# EAGLE board PDNode-600 Pro (EAGLE 9.2.1), part 1 of 5
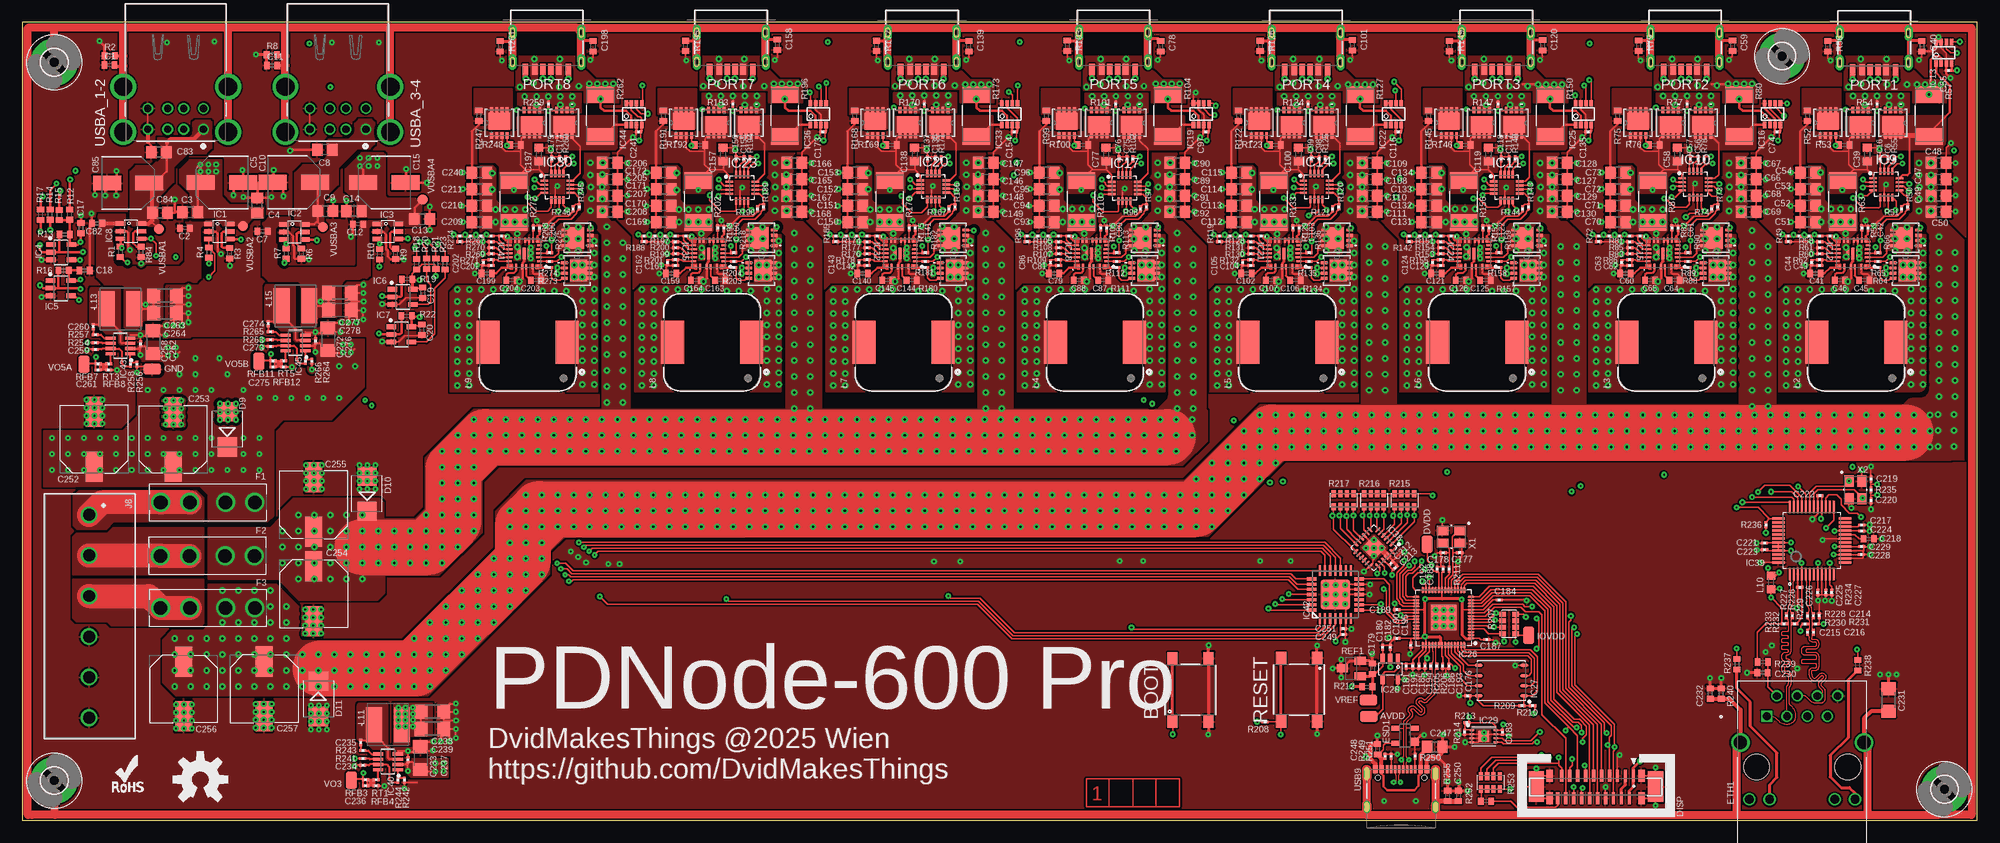
[diagram p12: board, top side]
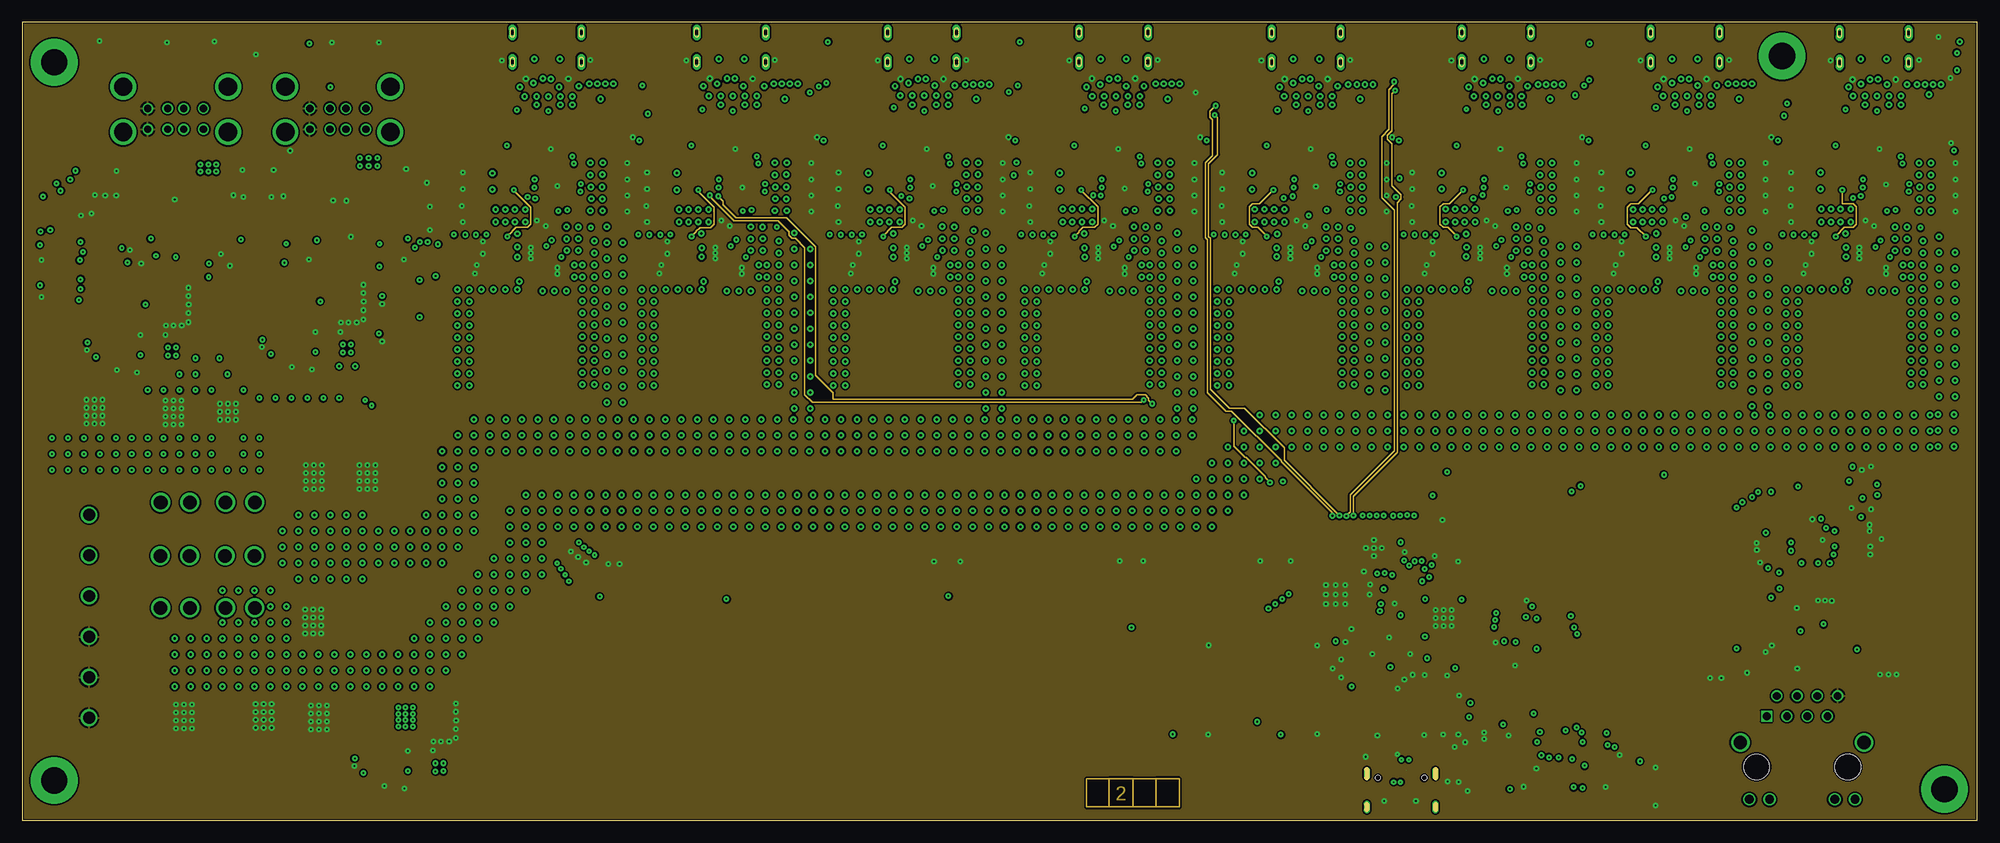
[diagram p13: board, inner layer GND]
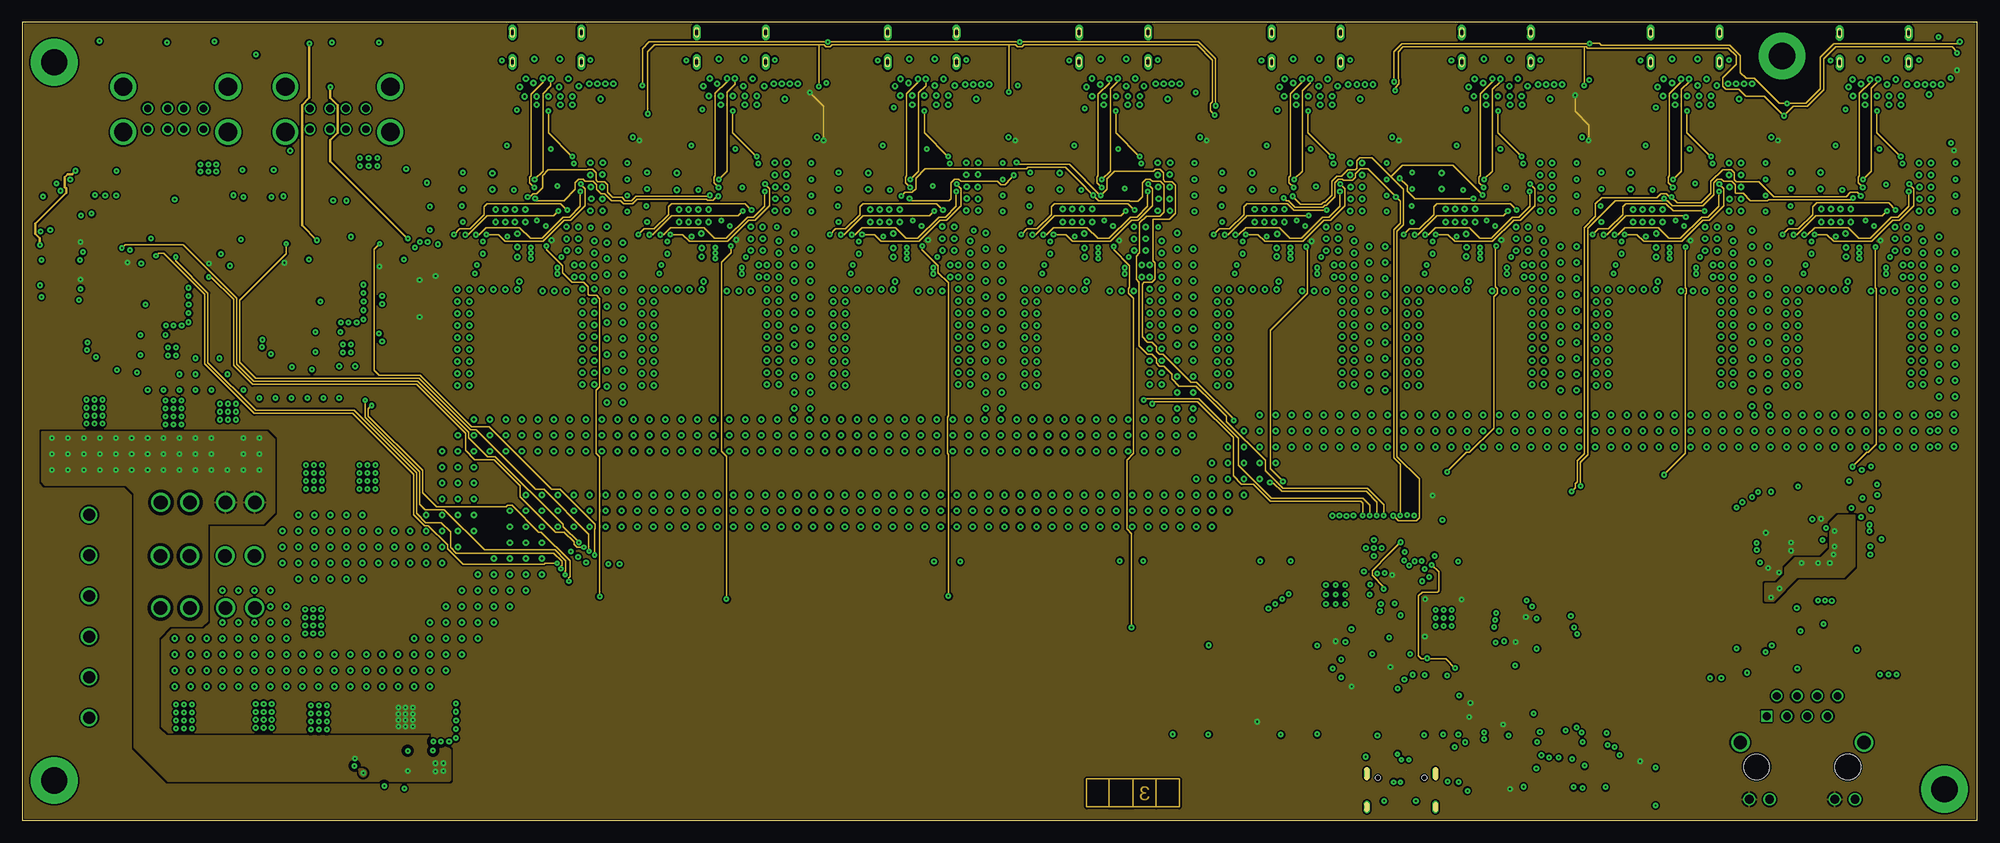
[diagram p14: board, inner layer PWR]
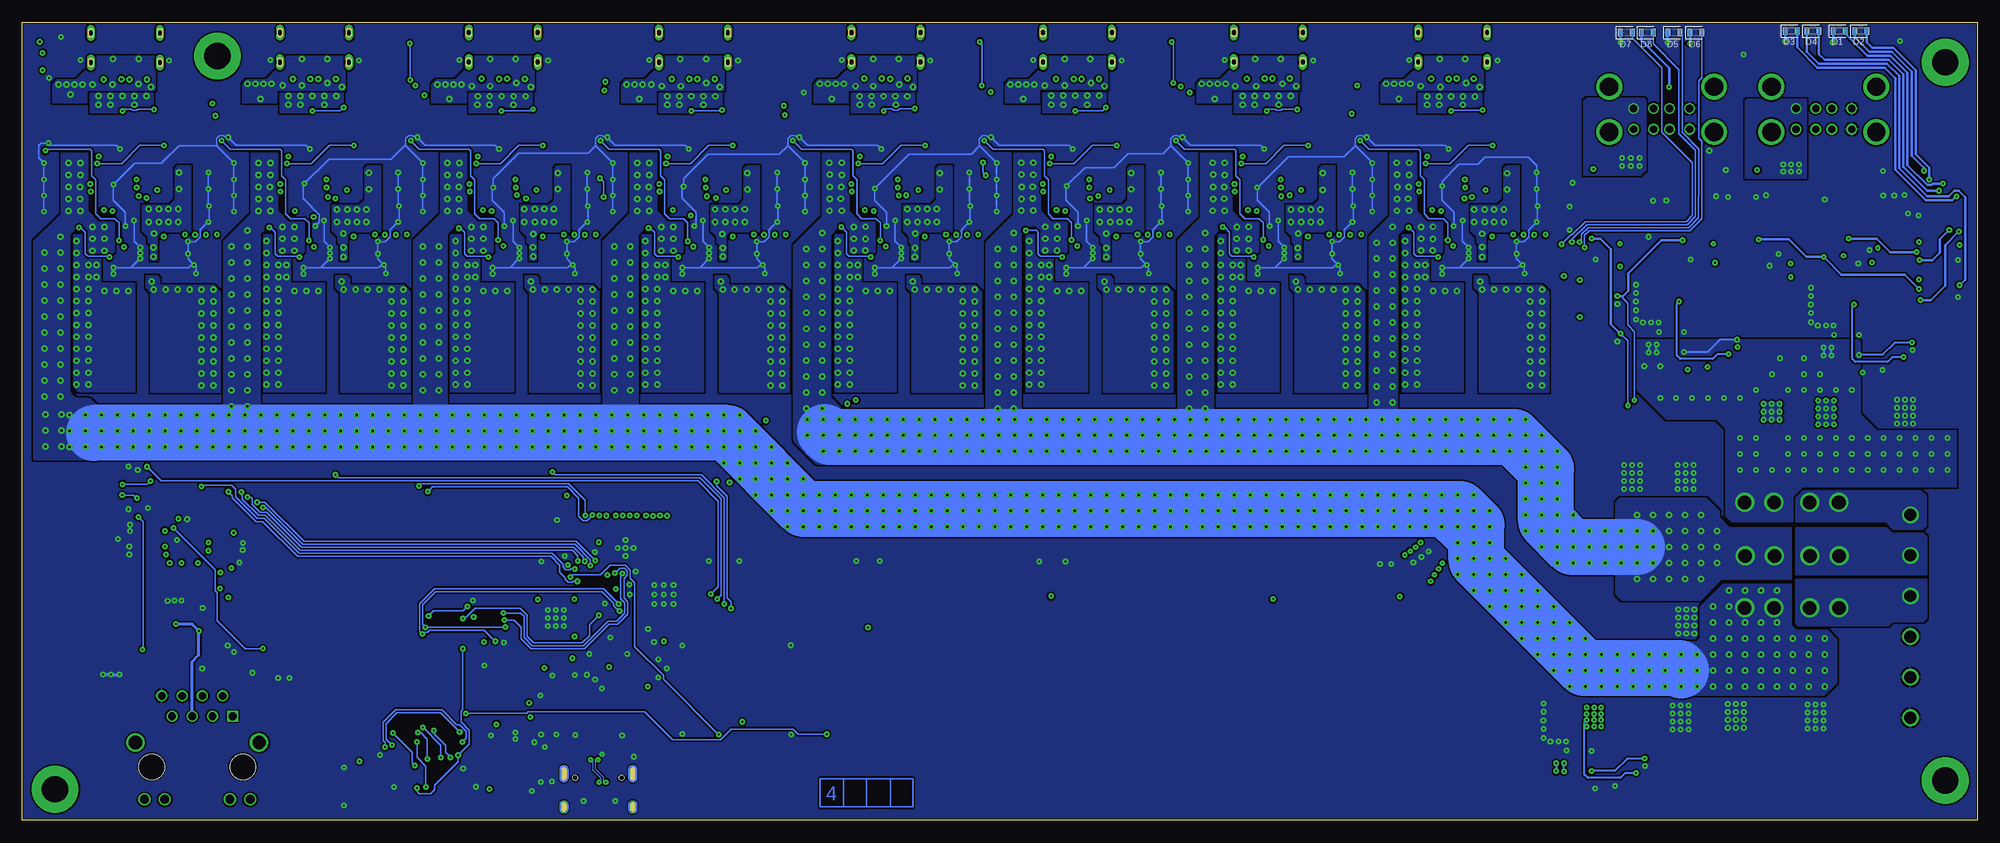
[diagram p15: board, bottom side, seen from below]

Size 245 x 100 mm. Coordinates in mm from the lower left corner, seen from the top.
Outline: 0,0 245,0 245,100 0,100 0,0
Copper layers (1+2*15+16): SIG-HS 0.035mm / dielectric 0.0994mm / GND 0.0152mm / dielectric 1.265mm / PWR 0.0152mm / dielectric 0.0994mm / SIG 0.035mm
Design rules "JLC04161H-3313": minimum track width 3.5mil, minimum drill 0.15mm, track to track 3.5mil, track to pad 3.5mil, pad to pad 3.5mil, via to via 3.5mil, smd to smd 3.5mil, copper to edge 0.2mm, drill to drill 6mil, minimum pad ring 8mil, minimum via ring 0.25mm, stop-mask expansion 0.05mm, vias tented up to drill 16mil, thermal gap 10mil
Net classes: 0 default: width 0.2 mm, drill 0.15 mm, clearance 0.178 mm; 1 100R_DIFFPAIR: width 0.121 mm, drill 0.15 mm, clearance 0.191 mm; 2 90R_DIFFPAIR: width 0.155 mm, drill 0.15 mm, clearance 0.191 mm
tKeepout: area 133.3,1.6 to 145.1,5.3
bKeepout: area 133.3,1.6 to 145.1,5.3
tRestrict: area 133.3,1.6 to 145.1,5.3
bRestrict: area 133.3,1.6 to 145.1,5.3
vRestrict: area 133.3,1.6 to 145.1,5.3

## Footprints (pad centres in the part's own frame; a part is rotated, then mirrored left to right if it is on the bottom)
TP = smd 2.2 x 1.4: TP 0,0
430182050816 = smd 1.55 x 1.3: 1 -3.975,2.25; 2 -3.975,-2.25; 3 3.975,2.25; 4 3.975,-2.25
C0402 = smd 0.7 x 0.9: 1 -0.65,0; 2 0.65,0
C0805 = smd 1.3 x 1.5: 1 -0.95,0; 2 0.95,0
100UF-16V = smd 3.5 x 1.85: 1 -2.65,0; 2 2.65,0
0201 = smd 0.34 x 0.35: 1 -0.275,0; 2 0.275,0
C0603 = smd 1 x 1.1: 1 -0.85,0; 2 0.85,0
C1206 = smd 1.6 x 1.803: 1 -1.422,0; 2 1.422,0
0805 = smd 1.3 x 1.5: 1 -0.95,0; 2 0.95,0
0402 = smd 0.7 x 0.9: 1 -0.65,0; 2 0.65,0
CAPAE830X1050N = smd 3.764 x 2.115: 1 -3.426,0; 2 3.426,0
LEDC1608X35N_FLAT-G = smd 0.612 x 0.912: A 0.75,0; C -0.75,0
LEDC1608X35N_FLAT-R = smd 0.612 x 0.912: A 0.75,0; C -0.75,0
SMB = smd 2.4 x 2.4: A 2.2,0; C -2.2,0
FPC20 = smd 0.4 x 1.5: 1 -4.552,-1.362; 2 -4.052,1.438; 3 -3.552,-1.362; 4 -3.052,1.438; 5 -2.552,-1.362; 6 -2.052,1.438; 7 -1.552,-1.362; 8 -1.052,1.438; 9 -0.552,-1.362; 10 -0.052,1.438; 11 0.448,-1.362; 12 0.948,1.438; 13 1.448,-1.362; 14 1.948,1.438; 15 2.448,-1.362; 16 2.948,1.438; 17 3.448,-1.362; 18 3.948,1.438; 19 4.448,-1.362; 20 4.948,1.438 | smd 1.93 x 3.81: Z0 -7.303,0; Z5 7.62,0 | smd 0.8 x 1.5: Z1 -5.552,-1.362; Z2 -5.552,1.438; Z3 5.948,-1.362; Z4 5.948,1.438
SOT143 = smd 1 x 1: 1 -0.75,-1.2 | smd 0.6 x 1: 2 0.95,-1.2; 3 0.95,1.2; 4 -0.95,1.2
RJ45-CAT5 = drill 0.97 square: 1 -4.445,6.35 | drill 0.97: 2 -3.175,8.89; 3 -1.905,6.35; 4 -0.635,8.89; 5 0.635,6.35; 6 1.905,8.89; 7 3.175,6.35; 8 4.445,8.89 | drill 1.1: 9 -6.625,-4.06; 10 -4.085,-4.06; 11 4.085,-4.06; 12 6.625,-4.06 | drill 1.65: S1 -7.745,3.05; S2 7.745,3.05 | hole 3.25: 5.715,0; -5.715,0
FUSE_3544-2 = drill 1.7: 1_1 -5.895,0; 1_2 -2.235,0; 2_1 2.235,0; 2_2 5.895,0
3,3-PAD = drill 3.3 pad 5.842: B3,3 0,0
SOT23-6 = smd 0.55 x 1.2: 1 -0.95,-1.3; 2 0,-1.3; 3 0.95,-1.3; 4 0.95,1.3; 5 0,1.3; 6 -0.95,1.3
SOT95P280X145-5N = smd 1.186 x 0.597: 1 -1.264,0.95; 2 -1.264,0; 3 -1.264,-0.95; 4 1.264,-0.95; 5 1.264,0.95
QFN50P300X300X55-16N = smd 0.937 x 0.264: 1 -1.641,0.75; 2 -1.641,0.25; 3 -1.641,-0.25; 4 -1.641,-0.75; 9 1.641,-0.75; 10 1.641,-0.25; 11 1.641,0.25; 12 1.641,0.75 | smd 0.264 x 0.937: 5 -0.75,-1.641; 6 -0.25,-1.641; 7 0.25,-1.641; 8 0.75,-1.641; 13 0.75,1.641; 14 0.25,1.641; 15 -0.25,1.641; 16 -0.75,1.641
RPM0026A-MFG = smd 0.306 x 0.306: 1 -1.661,1.555 | smd 0.6 x 0.25: 2 -1.9,1; 6 -1.9,-1; 14 1.9,-1; 18 1.9,1 | smd 0.725 x 0.25: 3 -1.837,0.5; 4 -1.837,0; 5 -1.837,-0.5; 15 1.837,-0.5; 16 1.837,0; 17 1.837,0.5 | smd 0.29 x 0.29: 7 -1.661,-1.554 | smd 0.25 x 0.625: 8 -1.125,-1.637; 9 -0.625,-1.637; 10 -0.125,-1.637; 11 0.625,-1.637; 12 1.125,-1.637 | smd 0.259 x 0.259: 13 1.644,-1.805 | smd 0.332 x 0.332: 19 1.641,1.591 | smd 0.25 x 0.675: 20 1.05,1.613; 23 -1.05,1.613 | smd 0.25 x 0.6: 21 0.25,1.65; 22 -0.25,1.65 | smd 0.375 x 1.425: 24 -0.625,0; 25 0,0; 26 0.625,0
SOT23-8 = smd 0.45 x 0.8: 1 -0.975,-1.35; 2 -0.325,-1.35; 3 0.325,-1.35; 4 0.975,-1.35; 5 0.975,1.35; 6 0.325,1.35; 7 -0.325,1.35; 8 -0.975,1.35
QFN40P700X700X100-57T510 = smd 0.837 x 0.22: 1 -3.437,2.6; 2 -3.437,2.2; 3 -3.437,1.8; 4 -3.437,1.4; 5 -3.437,1; 6 -3.437,0.6; 7 -3.437,0.2; 8 -3.437,-0.2; 9 -3.437,-0.6; 10 -3.437,-1; 11 -3.437,-1.4; 12 -3.437,-1.8; 13 -3.437,-2.2; 14 -3.437,-2.6; 29 3.437,-2.6; 30 3.437,-2.2; 31 3.437,-1.8; 32 3.437,-1.4; 33 3.437,-1; 34 3.437,-0.6; 35 3.437,-0.2; 36 3.437,0.2; 37 3.437,0.6; 38 3.437,1; 39 3.437,1.4; 40 3.437,1.8; 41 3.437,2.2; 42 3.437,2.6 | smd 0.22 x 0.837: 15 -2.6,-3.437; 16 -2.2,-3.437; 17 -1.8,-3.437; 18 -1.4,-3.437; 19 -1,-3.437; 20 -0.6,-3.437; 21 -0.2,-3.437; 22 0.2,-3.437; 23 0.6,-3.437; 24 1,-3.437; 25 1.4,-3.437; 26 1.8,-3.437; 27 2.2,-3.437; 28 2.6,-3.437; 43 2.6,3.437; 44 2.2,3.437; 45 1.8,3.437; 46 1.4,3.437; 47 1,3.437; 48 0.6,3.437; 49 0.2,3.437; 50 -0.2,3.437; 51 -0.6,3.437; 52 -1,3.437; 53 -1.4,3.437; 54 -1.8,3.437; 55 -2.2,3.437; 56 -2.6,3.437 | smd 3.2 x 3.2: 57 0,0
SON127P600X500X75-8N = smd 1.012 x 0.432: 1 -2.85,1.905; 2 -2.85,0.635; 3 -2.85,-0.635; 4 -2.85,-1.905; 5 2.85,-1.905; 6 2.85,-0.635; 7 2.85,0.635; 8 2.85,1.905
SOT23-5 = smd 0.55 x 1.2: 1 -0.95,-1.3; 2 0,-1.3; 3 0.95,-1.3; 4 0.95,1.3; 5 -0.95,1.3
SON50P300X200X50-9T130X140N = smd 0.711 x 0.27: 1 -1.501,0.75; 2 -1.501,0.25; 3 -1.501,-0.25; 4 -1.501,-0.75; 5 1.501,-0.75; 6 1.501,-0.25; 7 1.501,0.25; 8 1.501,0.75 | smd 1.3 x 1.4: 9 0,0
QFN50P400X400X100-25T210N = smd 0.86 x 0.264: 1 -1.935,1.25; 2 -1.935,0.75; 3 -1.935,0.25; 4 -1.935,-0.25; 5 -1.935,-0.75; 6 -1.935,-1.25; 13 1.935,-1.25; 14 1.935,-0.75; 15 1.935,-0.25; 16 1.935,0.25; 17 1.935,0.75; 18 1.935,1.25 | smd 0.264 x 0.86: 7 -1.25,-1.935; 8 -0.75,-1.935; 9 -0.25,-1.935; 10 0.25,-1.935; 11 0.75,-1.935; 12 1.25,-1.935; 19 1.25,1.935; 20 0.75,1.935; 21 0.25,1.935; 22 -0.25,1.935; 23 -0.75,1.935; 24 -1.25,1.935 | smd 2.1 x 2.1: 25 0,0
LQFP48 = smd 1.56 x 0.28: 1 -4.18,2.75; 2 -4.18,2.25; 3 -4.18,1.75; 4 -4.18,1.25; 5 -4.18,0.75; 6 -4.18,0.25; 7 -4.18,-0.25; 8 -4.18,-0.75; 9 -4.18,-1.25; 10 -4.18,-1.75; 11 -4.18,-2.25; 12 -4.18,-2.75; 25 4.18,-2.75; 26 4.18,-2.25; 27 4.18,-1.75; 28 4.18,-1.25; 29 4.18,-0.75; 30 4.18,-0.25; 31 4.18,0.25; 32 4.18,0.75; 33 4.18,1.25; 34 4.18,1.75; 35 4.18,2.25; 36 4.18,2.75 | smd 0.28 x 1.56: 13 -2.75,-4.18; 14 -2.25,-4.18; 15 -1.75,-4.18; 16 -1.25,-4.18; 17 -0.75,-4.18; 18 -0.25,-4.18; 19 0.25,-4.18; 20 0.75,-4.18; 21 1.25,-4.18; 22 1.75,-4.18; 23 2.25,-4.18; 24 2.75,-4.18; 37 2.75,4.18; 38 2.25,4.18; 39 1.75,4.18; 40 1.25,4.18; 41 0.75,4.18; 42 0.25,4.18; 43 -0.25,4.18; 44 -0.75,4.18; 45 -1.25,4.18; 46 -1.75,4.18; 47 -2.25,4.18; 48 -2.75,4.18
SOT65P280X110-8N = smd 1.259 x 0.4: 1 -1.228,0.975; 2 -1.228,0.325; 3 -1.228,-0.325; 4 -1.228,-0.975; 5 1.228,-0.975; 6 1.228,-0.325; 7 1.228,0.325; 8 1.228,0.975
QFN28[6X6]ML = smd 1.27 x 0.35: 1 -2.985,1.95; 2 -2.985,1.3; 3 -2.985,0.65; 4 -2.985,0; 5 -2.985,-0.65; 6 -2.985,-1.3; 7 -2.985,-1.95; 15 2.985,-1.95; 16 2.985,-1.3; 17 2.985,-0.65; 18 2.985,0; 19 2.985,0.65; 20 2.985,1.3; 21 2.985,1.95 | smd 0.35 x 1.27: 8 -1.95,-2.985; 9 -1.3,-2.985; 10 -0.65,-2.985; 11 0,-2.985; 12 0.65,-2.985; 13 1.3,-2.985; 14 1.95,-2.985; 22 1.95,2.985; 23 1.3,2.985; 24 0.65,2.985; 25 0,2.985; 26 -0.65,2.985; 27 -1.3,2.985; 28 -1.95,2.985 | smd 3.7 x 3.7: PAD 0,0
691244510006 = drill 1.5: 1 -12.7,0; 2 -7.62,0; 3 -2.54,0; 4 2.54,0; 5 7.62,0; 6 12.7,0
WE-PD_1280 = smd 5.4 x 2.9: 1 0,-4.95; 2 0,4.95
0603 = smd 1 x 1.1: 1 -0.85,0; 2 0.85,0
SRR5228A = smd 4.4 x 2: 1 0,1.75; 2 0,-1.75
632722100213 = smd 0.7 x 1.4: A5 -0.5,2.75; A9 1.5,2.75; A12 2.7,2.75; B5 0.5,2.75; B9 -1.5,2.75; B12 -2.7,2.75 | drill 0.6 pad 0.7 long: S1 -4.32,1.85; S2 4.32,1.85; S3 4.32,-1.85; S4 -4.32,-1.85
R0201 = smd 0.34 x 0.35: 1 -0.275,0; 2 0.275,0
2512 = smd 2.08 x 3.44: 1 -2.616,0; 2 2.616,0
742C083103JP = smd 0.59 x 0.92: 1 -1.2,-0.8; 2 -0.4,-0.8; 3 0.4,-0.8; 4 1.2,-0.8; 5 1.2,0.8; 6 0.4,0.8; 7 -0.4,0.8; 8 -1.2,0.8
YC164-JR-0733RL = smd 0.67 x 0.85: 1 -1.24,-0.81; 4 1.24,-0.81; 5 1.24,0.81; 8 -1.24,0.81 | smd 0.59 x 0.85: 2 -0.4,-0.81; 3 0.4,-0.81; 6 0.4,0.81; 7 -0.4,0.81
SOT23 = smd 1 x 1.4: 1 -0.95,-1.1; 2 0.95,-1.1; 3 0,1.1
POWERDI3333-8_UX_DIO-L = smd 0.813 x 0.356: 1 -1.6,0.975; 2 -1.6,0.325; 3 -1.6,-0.325; 4 -1.6,-0.975; 5 1.549,-0.975; 6 1.549,-0.325; 7 1.549,0.325; 8 1.549,0.975 | smd 2.1 x 2.69: 9 0.2,0
USB-C = smd 0.3 x 1: A5 -1.18,3.37; A6 -0.18,3.37; A7 0.32,3.37; A8 1.32,3.37; B5 1.82,3.37; B6 0.82,3.37; B7 -0.68,3.37; B8 -1.68,3.37 | smd 0.6 x 1: GND -3.155,3.37; GND2 3.295,3.37; VBUS1 -2.38,3.37; VBUS2 2.52,3.37 | drill 0.4 pad 0.6 long: SHLD1 -4.248,2.795; SHLD2 4.388,2.795; SHLD3 -4.248,-1.385; SHLD4 4.388,-1.385 | hole 0.65: -2.82,2.265; 2.96,2.265
61400826021 = drill 0.92: 1 -3.5,7.11; 2 -1,7.11; 3 1,7.11; 4 3.5,7.11; 5 -3.5,4.49; 6 -1,4.49; 7 1,4.49; 8 3.5,4.49 | drill 2.3: S1 -6.57,7.46; S2 6.57,7.46; S3 -6.57,1.78; S4 6.57,1.78
B1,27 = smd 1.27 x 1.27: TP 0,0
WE-XTAL_CFPX-180 = smd 1.4 x 1.15: 1 -1.1,-0.8; 2 1.1,-0.8; 3 1.1,0.8; 4 -1.1,0.8

## Placement (x,y rotation side)
AVDD  TP  [TP]  168.77,13.03 180 top
BOOT  430182043816  [430182050816]  146.4,16.35 90 top
C1  4.7nF  [C0402]  10.92,94.66 0 top
C2  100nF  [C0402]  20.38,74.22 180 top
C3  10uF  [C0805]  21.04,76.18 180 top
C4  10uF  [C0805]  29.44,77.05 90 top
C5  100uF 16V  [100UF-16V]  25.01,79.93 0 top
C6  1uF 10V  [0201]  233.84,82.9 90 top
C7  100nF  [C0402]  30.13,73.82 180 top
C8  10uF  [C0805]  37.93,84.04 180 top
C9  10uF  [C0805]  37.99,76.36 0 top
C10  100uF 16V  [100UF-16V]  34.05,79.97 180 top
C11  4.7nF  [C0402]  31.29,94.6 0 top
C12  100nF  [C0402]  42.08,74.72 180 top
C13  10uF  [C0805]  50.11,75.36 0 top
C14  10uF  [C0805]  41.57,76.34 180 top
C15  100uF 16V  [100UF-16V]  45.39,79.93 0 top
C16  1uF 10V  [0201]  232.85,82.9 90 top
C17  100nF  [C0402]  7.34,74.22 90 top
C18  100nF  [C0402]  7.8,68.9 0 top
C19  100nF  [C0402]  50.18,66.13 270 top
C20  100nF  [C0402]  50.08,61.48 270 top
C39  1uF 50V  [C0603]  231.23,83.43 90 top
C40  4.7nF  [C0402]  238.07,97.02 90 top
C41  4.7uF  [C0402]  224.71,68.54 180 top
C42  10nF  [0201]  231.32,74.22 90 top
C43  10nF  [0201]  225.26,69.52 180 top
C44  10nF  [0201]  224.26,69.89 270 top
C45  100nF  [C0402]  230.87,67.69 180 top
C46  100nF  [C0402]  227.81,67.7 180 top
C47  10uF 50V  [C0805]  240.16,80.34 0 top
C48  10uF 50V  [C0805]  240.16,82.38 0 top
C49  10uF 50V  [C0805]  240.16,78.3 0 top
C50  10uF 50V  [C0805]  240.16,76.26 0 top
C51  22uF 50V  [C0805]  223.8,74.95 180 top
C52  22uF 50V  [C0805]  223.8,77.01 180 top
C53  22uF 50V  [C0805]  223.8,79.1 180 top
C54  22uF 50V  [C0805]  223.8,81.18 180 top
C55  100nF  [0201]  241.4,93.96 180 top
C56  1uF 10V  [0201]  210.04,82.9 90 top
C57  1uF 10V  [0201]  209.05,82.9 90 top
C58  1uF 50V  [C0603]  207.43,83.43 90 top
C59  4.7nF  [C0402]  214.34,97.06 90 top
C60  4.7uF  [C0402]  200.91,68.54 180 top
C61  10nF  [0201]  207.52,74.22 90 top
C62  10nF  [0201]  201.46,69.52 180 top
C63  10nF  [0201]  200.46,69.89 270 top
C64  100nF  [C0402]  207.07,67.69 180 top
C65  100nF  [C0402]  204.01,67.7 180 top
C66  10uF 50V  [C0805]  216.36,80.34 0 top
C67  10uF 50V  [C0805]  216.36,82.38 0 top
C68  10uF 50V  [C0805]  216.36,78.3 0 top
C69  10uF 50V  [C0805]  216.36,76.26 0 top
C70  22uF 50V  [C0805]  200,74.95 180 top
C71  22uF 50V  [C0805]  200,77.01 180 top
C72  22uF 50V  [C0805]  200,79.1 180 top
C73  22uF 50V  [C0805]  200,81.18 180 top
C74  100nF  [0201]  219.93,86.28 180 top
C75  1uF 10V  [0201]  138.44,82.9 90 top
C76  1uF 10V  [0201]  137.45,82.9 90 top
C77  1uF 50V  [C0603]  135.83,83.43 90 top
C78  4.7nF  [C0402]  142.67,97.02 90 top
C79  4.7uF  [C0402]  129.31,68.54 180 top
C80  10nF  [0201]  135.92,74.22 90 top
C81  10nF  [0201]  129.86,69.52 180 top
C82  100nF  [C0402]  9.36,74.82 180 top
C83  10uF  [C0805]  17.12,83.71 180 top
C84  10uF  [C0805]  17.24,76.15 0 top
C85  100uF 16V  [100UF-16V]  13.27,79.87 180 top
C86  10nF  [0201]  128.86,69.89 270 top
C87  100nF  [C0402]  135.47,67.69 180 top
C88  100nF  [C0402]  132.41,67.7 180 top
C89  10uF 50V  [C0805]  144.76,80.34 0 top
C90  10uF 50V  [C0805]  144.76,82.38 0 top
C91  10uF 50V  [C0805]  144.76,78.3 0 top
C92  10uF 50V  [C0805]  144.76,76.26 0 top
C93  22uF 50V  [C0805]  128.4,74.95 180 top
C94  22uF 50V  [C0805]  128.4,77.01 180 top
C95  22uF 50V  [C0805]  128.4,79.1 180 top
C96  22uF 50V  [C0805]  128.4,81.18 180 top
C97  100nF  [0201]  148.33,86.28 180 top
C98  1uF 10V  [0201]  162.54,82.9 90 top
C99  1uF 10V  [0201]  161.55,82.9 90 top
C100  1uF 50V  [C0603]  159.93,83.43 90 top
C101  4.7nF  [C0402]  166.69,97.14 90 top
C102  4.7uF  [C0402]  153.41,68.54 180 top
C103  10nF  [0201]  160.02,74.22 90 top
C104  10nF  [0201]  153.96,69.52 180 top
C105  10nF  [0201]  152.96,69.89 270 top
C106  100nF  [C0402]  159.57,67.69 180 top
C107  100nF  [C0402]  156.51,67.7 180 top
C108  10uF 50V  [C0805]  168.86,80.34 0 top
C109  10uF 50V  [C0805]  168.86,82.38 0 top
C110  10uF 50V  [C0805]  168.86,78.3 0 top
C111  10uF 50V  [C0805]  168.86,76.26 0 top
C112  22uF 50V  [C0805]  152.5,74.95 180 top
C113  22uF 50V  [C0805]  152.5,77.01 180 top
C114  22uF 50V  [C0805]  152.5,79.1 180 top
C115  22uF 50V  [C0805]  152.5,81.18 180 top
C116  100nF  [0201]  172.43,86.28 180 top
C117  1uF 10V  [0201]  186.34,82.9 90 top
C118  1uF 10V  [0201]  185.35,82.9 90 top
C119  1uF 50V  [C0603]  183.73,83.43 90 top
C120  4.7nF  [C0402]  190.53,97.13 90 top
C121  4.7uF  [C0402]  177.21,68.54 180 top
C122  10nF  [0201]  183.82,74.22 90 top
C123  10nF  [0201]  177.76,69.52 180 top
C124  10nF  [0201]  176.76,69.89 270 top
C125  100nF  [C0402]  183.37,67.69 180 top
C126  100nF  [C0402]  180.31,67.7 180 top
C127  10uF 50V  [C0805]  192.66,80.34 0 top
C128  10uF 50V  [C0805]  192.66,82.38 0 top
C129  10uF 50V  [C0805]  192.66,78.3 0 top
C130  10uF 50V  [C0805]  192.66,76.26 0 top
C131  22uF 50V  [C0805]  176.3,74.95 180 top
C132  22uF 50V  [C0805]  176.3,77.01 180 top
C133  22uF 50V  [C0805]  176.3,79.1 180 top
C134  22uF 50V  [C0805]  176.3,81.18 180 top
C135  100nF  [0201]  196.23,86.28 180 top
C136  1uF 10V  [0201]  114.44,82.9 90 top
C137  1uF 10V  [0201]  113.45,82.9 90 top
C138  1uF 50V  [C0603]  111.83,83.43 90 top
C139  4.7nF  [C0402]  118.63,97.02 90 top
C140  4.7uF  [C0402]  105.31,68.54 180 top
C141  10nF  [0201]  111.92,74.22 90 top
C142  10nF  [0201]  105.86,69.52 180 top
C143  10nF  [0201]  104.86,69.89 270 top
C144  100nF  [C0402]  111.47,67.69 180 top
C145  100nF  [C0402]  108.41,67.7 180 top
C146  10uF 50V  [C0805]  120.76,80.34 0 top
C147  10uF 50V  [C0805]  120.76,82.38 0 top
C148  10uF 50V  [C0805]  120.76,78.3 0 top
C149  10uF 50V  [C0805]  120.76,76.26 0 top
C150  22uF 50V  [C0805]  104.4,74.95 180 top
C151  22uF 50V  [C0805]  104.4,77.01 180 top
C152  22uF 50V  [C0805]  104.4,79.1 180 top
C153  22uF 50V  [C0805]  104.4,81.18 180 top
C154  100nF  [0201]  124.33,86.28 180 top
C155  1uF 10V  [0201]  90.44,82.9 90 top
C156  1uF 10V  [0201]  89.45,82.9 90 top
C157  1uF 50V  [C0603]  87.83,83.43 90 top
C158  4.7nF  [C0402]  94.63,97.2 90 top
C159  4.7uF  [C0402]  81.31,68.54 180 top
C160  10nF  [0201]  87.92,74.22 90 top
C161  10nF  [0201]  81.86,69.52 180 top
C162  10nF  [0201]  80.86,69.89 270 top
C163  100nF  [C0402]  87.47,67.69 180 top
C164  100nF  [C0402]  84.41,67.7 180 top
C165  10uF 50V  [C0805]  96.76,80.34 0 top
C166  10uF 50V  [C0805]  96.76,82.38 0 top
C167  10uF 50V  [C0805]  96.76,78.3 0 top
C168  10uF 50V  [C0805]  96.76,76.26 0 top
C169  22uF 50V  [C0805]  80.4,74.95 180 top
C170  22uF 50V  [C0805]  80.4,77.01 180 top
C171  22uF 50V  [C0805]  80.4,79.1 180 top
C172  22uF 50V  [C0805]  80.4,81.18 180 top
C173  100nF  [0201]  100.33,86.28 180 top
C174  1uF 10V  [0201]  67.34,82.9 90 top
C175  1uF 10V  [0201]  66.35,82.9 90 top
C176  100nF  [0201]  181.16,15.61 180 top
C177  15pF  [0201]  180.14,33.55 0 top
C178  15pF  [0201]  178.07,33.54 180 top
C179  1uF  [C0402]  169.22,19.01 90 top
C180  100nF  [0201]  170.5,21.7 90 top
C181  100nF  [0201]  173.44,19.34 270 top
C182  100nF  [0201]  171.45,21.7 90 top
C183  100nF  [0201]  185.51,11.05 270 top
C184  100nF  [0201]  185.11,27.62 0 top
C185  100nF  [0201]  175.04,19.33 270 top
C186  100nF  [0201]  178.02,19.33 270 top
C187  100nF  [0201]  183.55,22.66 0 top
C188  100nF  [0201]  178.08,31.49 90 top
C189  100nF  [0201]  172.28,26.41 180 top
C190  100nF  [0201]  172.28,22.81 180 top
C191  100nF  [0201]  174.27,19.33 270 top
C192  100nF  [0201]  177.33,31.49 90 top
C193  100nF  [0201]  178.79,19.33 270 top
C194  100nF  [0201]  175.78,19.33 270 top
C195  100nF  [0201]  174.02,21.95 270 top
C197  1uF 50V  [C0603]  64.73,83.43 90 top
C198  4.7nF  [C0402]  71.53,97.02 90 top
C199  4.7uF  [C0402]  58.21,68.54 180 top
C200  10nF  [0201]  64.82,74.22 90 top
C201  10nF  [0201]  58.76,69.52 180 top
C202  10nF  [0201]  57.76,69.89 270 top
C203  100nF  [C0402]  64.37,67.69 180 top
C204  100nF  [C0402]  61.31,67.7 180 top
C205  10uF 50V  [C0805]  73.66,80.34 0 top
C206  10uF 50V  [C0805]  73.66,82.38 0 top
C207  10uF 50V  [C0805]  73.66,78.3 0 top
C208  10uF 50V  [C0805]  73.66,76.26 0 top
C209  22uF 50V  [C0805]  57.3,74.95 180 top
C210  22uF 50V  [C0805]  57.3,77.01 180 top
C211  22uF 50V  [C0805]  57.3,79.1 180 top
C212  100nF  [0201]  171.52,32.2 45 top
C213  1uF  [0201]  172.06,31.65 45 top
C214  100nF  [0201]  225.2,25.66 90 top
C215  6.8nF  [0201]  223.73,23.58 270 top
C216  6.8nF  [0201]  224.47,23.58 270 top
C217  100nF  [0201]  230.52,37.03 0 top
C218  4.7uF  [C0402]  231.4,35.28 0 top
C219  18pF  [0201]  231.69,42.78 90 top
C220  18pF  [0201]  231.69,40.08 270 top
C221  100nF  [0201]  218.34,34.75 180 top
C222  100nF  [0201]  225.29,40.69 180 top
C223  100nF  [0201]  218.35,33.91 180 top
C224  100nF  [0201]  230.52,36.26 0 top
C225  100nF  [0201]  225.02,28.56 270 top
C226  100nF  [0201]  222.79,29.21 180 top
C227  100nF  [0201]  226.77,28.56 270 top
C228  100nF  [0201]  230.48,33.31 0 top
C229  100nF  [0201]  230.52,34.32 0 top
C230  22nF  [C0402]  218.1,18.51 180 top
C231  C1206C102KGRACTM  [C1206]  233.9,15.09 270 top
C232  4.7nF  [C0402]  211.54,15.9 270 top
C233  100nF  [0201]  48.34,7.6 90 top
C234  100nF  [0201]  42.67,6.91 180 top
C235  100nF  [0201]  42.4,9.77 90 top
C236  33pF  [0201]  43.01,4.34 0 top
C237  22uF 25V  [C1206]  49.9,7.81 90 top
C238  22uF - 10V  [C1206]  51.4,13.62 0 top
C239  22uF - 10V  [C1206]  51.4,11.47 0 top
C240  22uF 50V  [C0805]  57.3,81.18 180 top
C241  100nF  [0201]  77.23,86.28 180 top
C247  10uF  [0805]  177.03,9.22 0 top
C248  100nF  [0402]  169.85,8.91 90 top
C249  100nF  [0201]  165.55,24.03 0 top
C250  4.7nF  [C0402]  179.99,3.07 90 top
C251  1uF  [0201]  165.55,23.3 0 top
C252  220uF 35V  [CAPAE830X1050N]  9,47.76 90 top
C253  220uF 35V  [CAPAE830X1050N]  18.9,47.73 90 top
C254  220uF 35V  [CAPAE830X1050N]  36.5,28.4 270 top
C255  220uF 35V  [CAPAE830X1050N]  36.5,39.57 90 top
C256  220uF 35V  [CAPAE830X1050N]  20.2,16.46 270 top
C257  220uF 35V  [CAPAE830X1050N]  30.3,16.49 270 top
C258  100nF  [0201]  14.82,59.71 90 top
C259  100nF  [0201]  9.15,59.02 180 top
C260  100nF  [0201]  8.88,61.88 90 top
C261  33pF  [0201]  9.49,56.45 0 top
C262  22uF 25V  [C1206]  16.38,59.92 90 top
C263  22uF - 10V  [C1206]  17.88,65.73 0 top
C264  22uF - 10V  [C1206]  17.88,63.58 0 top
C272  100nF  [0201]  36.75,60.08 90 top
C273  100nF  [0201]  31.08,59.39 180 top
C274  100nF  [0201]  30.81,62.25 90 top
C275  33pF  [0201]  31.42,56.82 0 top
C276  22uF 25V  [C1206]  38.31,60.29 90 top
C277  22uF - 10V  [C1206]  39.81,66.1 0 top
C278  22uF - 10V  [C1206]  39.81,63.95 0 top
D1  GREEN  [LEDC1608X35N_FLAT-G]  17.29,98.92 0 bottom
D2  RED  [LEDC1608X35N_FLAT-R]  14.6,98.92 0 bottom
D3  GREEN  [LEDC1608X35N_FLAT-G]  23.31,98.92 0 bottom
D4  RED  [LEDC1608X35N_FLAT-R]  20.58,98.92 0 bottom
D5  GREEN  [LEDC1608X35N_FLAT-G]  38.03,98.72 0 bottom
D6  RED  [LEDC1608X35N_FLAT-R]  35.26,98.72 0 bottom
D7  GREEN  [LEDC1608X35N_FLAT-G]  43.95,98.72 0 bottom
D8  RED  [LEDC1608X35N_FLAT-R]  41.34,98.72 0 bottom
D9  SMBJ33A  [SMB]  25.7,48.99 90 top
D10  SMBJ33A  [SMB]  43.2,40.93 90 top
D11  SMBJ33A  [SMB]  37.1,15.23 270 top
DISP  AFC11-S20ICC-00  [FPC20]  197.37,4.24 180 top
DVDD  TP  [TP]  176.09,34.59 90 top
ESD1  SP0503BAHTG-ES  [SOT143]  173.31,10.61 90 top
ETH1  SI-60118-F  [RJ45-CAT5]  223.07,6.71 0 top
F1  2A  [FUSE_3544-2]  23.24,39.84 0 top
F2  15A  [FUSE_3544-2]  23.18,33.16 0 top
F3  15A  [FUSE_3544-2]  23.23,26.62 0 top
GND  TP  [TP]  16.29,56.55 0 top
H1  MOUNT-PAD-ROUND3.3  [3,3-PAD]  240.9,3.9 0 top
H2  MOUNT-PAD-ROUND3.3  [3,3-PAD]  4,5 0 top
H3  MOUNT-PAD-ROUND3.3  [3,3-PAD]  4,95 0 top
H4  MOUNT-PAD-ROUND3.3  [3,3-PAD]  220.55,95.77 0 top
IC1  AP22653W6-7  [SOT23-6]  24.71,73.78 270 top
IC2  AP22653W6-7  [SOT23-6]  34.11,73.73 270 top
IC3  AP22653W6-7  [SOT23-6]  45.81,73.78 270 top
IC4  SN74LVC1G04DBVR  [SOT95P280X145-5N]  4.87,71.2 0 top
IC5  SN74LVC1G04DBVR  [SOT95P280X145-5N]  4.82,66.7 0 top
IC6  SN74LVC1G04DBVR  [SOT95P280X145-5N]  47.67,65.6 0 top
IC7  SN74LVC1G04DBVR  [SOT95P280X145-5N]  47.52,60.9 0 top
IC8  AP22653W6-7  [SOT23-6]  13.61,73.83 270 top
IC9  STUSB4710AQ1TR  [QFN50P300X300X55-16N]  233.6,79.7 0 top
IC10  STUSB4710AQ1TR  [QFN50P300X300X55-16N]  209.68,79.7 0 top
IC11  STUSB4710AQ1TR  [QFN50P300X300X55-16N]  186.03,79.31 0 top
IC12  TPS552882  [RPM0026A-MFG]  229.41,71.04 180 top
IC13  INA219BIDCNT  [SOT23-8]  240.82,96.19 0 top
IC14  STUSB4710AQ1TR  [QFN50P300X300X55-16N]  162.2,79.42 0 top
IC15  TPS552882  [RPM0026A-MFG]  205.61,71.04 180 top
IC16  INA219BIDCNT  [SOT23-8]  219.35,88.51 0 top
IC17  STUSB4710AQ1TR  [QFN50P300X300X55-16N]  138.15,79.24 0 top
IC18  TPS552882  [RPM0026A-MFG]  134.01,71.04 180 top
IC19  INA219BIDCNT  [SOT23-8]  147.75,88.51 0 top
IC20  STUSB4710AQ1TR  [QFN50P300X300X55-16N]  114.17,79.43 0 top
IC21  TPS552882  [RPM0026A-MFG]  158.11,71.04 180 top
IC22  INA219BIDCNT  [SOT23-8]  171.85,88.51 0 top
IC23  STUSB4710AQ1TR  [QFN50P300X300X55-16N]  90.22,79.28 0 top
IC24  TPS552882  [RPM0026A-MFG]  181.91,71.04 180 top
IC25  INA219BIDCNT  [SOT23-8]  195.65,88.51 0 top
IC26  RP2040  [QFN40P700X700X100-57T510]  178.13,25.41 180 top
IC27  W25Q128JVPIQ  [SON127P600X500X75-8N]  185.36,17.52 180 top
IC28  MCP6001R  [SOT23-5]  171.45,18.96 180 top
IC29  CAT24C512HU5IGT3  [SON50P300X200X50-9T130X140N]  183.16,10.55 0 top
IC30  STUSB4710AQ1TR  [QFN50P300X300X55-16N]  67.05,79.39 0 top
IC32  TPS552882  [RPM0026A-MFG]  110.01,71.04 180 top
IC33  INA219BIDCNT  [SOT23-8]  123.75,88.51 0 top
IC35  TPS552882  [RPM0026A-MFG]  86.01,71.04 180 top
IC36  INA219BIDCNT  [SOT23-8]  99.75,88.51 0 top
IC38  TCA9548ARGER  [QFN50P400X400X100-25T210N]  169.39,34.16 225 top
IC39  W5500  [LQFP48]  224.28,35.07 90 top
IC40  MP2315S  [SOT65P280X110-8N]  45.84,7.34 180 top
IC41  TPS552882  [RPM0026A-MFG]  62.91,71.04 180 top
IC42  MCP23017-E/ML  [QFN28[6X6]ML]  164.57,28.31 90 top
IC43  MP2315S  [SOT65P280X110-8N]  12.32,59.45 180 top
IC44  INA219BIDCNT  [SOT23-8]  76.65,88.51 0 top
IC45  MP2315S  [SOT65P280X110-8N]  34.25,59.82 180 top
IOVDD  TP  [TP]  188.76,23.23 90 top
J8  691244510006  [691244510006]  8.36,25.58 270 top
L2  4.7uH 744771004  [WE-PD_1280]  229.84,59.9 90 top
L3  4.7uH 744771004  [WE-PD_1280]  206.04,59.9 90 top
L4  4.7uH 744771004  [WE-PD_1280]  134.44,59.9 90 top
L5  4.7uH 744771004  [WE-PD_1280]  158.54,59.9 90 top
L6  4.7uH 744771004  [WE-PD_1280]  182.34,59.9 90 top
L7  4.7uH 744771004  [WE-PD_1280]  110.44,59.9 90 top
L8  4.7uH 744771004  [WE-PD_1280]  86.44,59.9 90 top
L9  4.7uH 744771004  [WE-PD_1280]  63.34,59.9 90 top
L10  BLM18EG221TN1D  [0603]  219.16,29.83 270 top
L11  4.2uH  [SRR5228A]  45.82,11.99 90 top
L13  4.9uH  [SRR5228A]  12.3,64.1 90 top
L15  4.9uH  [SRR5228A]  34.23,64.47 90 top
PORT1  632722100213  [632722100213]  232.08,96.81 180 top
PORT2  632722100213  [632722100213]  208.39,96.86 180 top
PORT3  632722100213  [632722100213]  184.73,96.89 180 top
PORT4  632722100213  [632722100213]  160.89,96.85 180 top
PORT5  632722100213  [632722100213]  136.76,96.89 180 top
PORT6  632722100213  [632722100213]  112.76,96.87 180 top
PORT7  632722100213  [632722100213]  88.83,96.89 180 top
PORT8  632722100213  [632722100213]  65.74,96.89 180 top
R1  10K  [0402]  12.28,71.27 90 top
R2  10K  [0402]  10.95,95.82 0 top
R3  20K 1%  [0402]  25.98,71.08 270 top
R4  10K  [0402]  23.38,71.15 90 top
R5  200K  [R0201]  226.57,73.24 180 top
R6  20K 1%  [0402]  34.98,71.03 270 top
R7  10K  [0402]  33.08,71.03 90 top
R8  10K  [0402]  31.27,95.94 0 top
R9  20K 1%  [0402]  46.78,70.98 270 top
R10  10K  [0402]  44.78,70.96 90 top
R11  12.7K 0.1%  [R0201]  225.26,73.24 180 top
R12  1K  [0402]  5.92,75.92 270 top
R13  10K  [0402]  5.3,73.42 0 top
R14  1K  [0402]  3.48,75.92 90 top
R15  1K  [0402]  4.62,75.86 270 top
R16  10K  [0402]  5.16,68.92 0 top
R17  1K  [0402]  2.28,75.88 90 top
R18  1K  [0402]  49.42,69.7 270 top
R19  10K  [0402]  48.22,67.82 0 top
R20  1K  [0402]  50.68,69.74 90 top
R21  1K  [0402]  51.82,69.74 270 top
R22  10K  [0402]  48.18,63.22 0 top
R23  1K  [0402]  52.98,69.7 90 top
R46  4.64K 0.1%  [R0201]  223.95,73.24 180 top
R47  4.64K 0.1%  [R0201]  222.65,73.24 180 top
R48  8.87K 0.1%  [R0201]  221.33,73.24 180 top
R49  30.9K 0.1%  [R0201]  221.33,72.52 0 top
R50  DNI  [R0201]  236.29,76.88 90 top
R51  100K  [R0201]  235.53,76.63 270 top
R52  10K  [0402]  223.73,88.3 270 top
R53  10K  [0402]  228.34,84.64 180 top
R54  10K  [R0201]  232.44,89.76 270 top
R55  2.2K  [R0201]  234.58,82.9 270 top
R56  10K  [0402]  226.28,97 90 top
R57  0.010R  [2512]  238.97,88.33 90 top
R58  6.19K  [R0201]  225.26,72.5 180 top
R59  49.9K  [R0201]  230.55,74.25 90 top
R60  19.9K  [R0201]  225.27,71.01 180 top
R61  150K  [R0201]  225.27,71.76 180 top
R62  19.9K  [R0201]  225.26,70.26 180 top
R63  0.010R  [2512]  228.13,77.55 90 top
R64  1K  [R0201]  232.56,69.29 0 top
R65  1K  [R0201]  232.56,70.04 0 top
R66  10K  [R0201]  232.56,71.14 180 top
R67  200K  [R0201]  202.77,73.24 180 top
R68  12.7K 0.1%  [R0201]  201.46,73.24 180 top
R69  4.64K 0.1%  [R0201]  200.15,73.24 180 top
R70  4.64K 0.1%  [R0201]  198.85,73.24 180 top
R71  8.87K 0.1%  [R0201]  197.53,73.24 180 top
R72  30.9K 0.1%  [R0201]  197.53,72.52 0 top
R73  100K  [R0201]  212.49,76.88 90 top
R74  DNI  [R0201]  211.73,76.63 270 top
R75  10K  [0402]  199.93,88.3 270 top
R76  10K  [0402]  204.54,84.64 180 top
R77  10K  [R0201]  208.64,89.76 270 top
R78  2.2K  [R0201]  210.78,82.9 270 top
R79  10K  [0402]  202.56,97.08 90 top
R80  0.010R  [2512]  215.17,88.33 90 top
R81  6.19K  [R0201]  201.46,72.5 180 top
R82  49.9K  [R0201]  206.75,74.25 90 top
R83  19.9K  [R0201]  201.47,71.01 180 top
R84  20K 1%  [0402]  14.88,71.23 270 top
R85  150K  [R0201]  201.47,71.76 180 top
R86  19.9K  [R0201]  201.46,70.26 180 top
R87  0.010R  [2512]  204.33,77.55 90 top
R88  1K  [R0201]  208.76,69.29 0 top
R89  1K  [R0201]  208.76,70.04 0 top
R90  10K  [R0201]  208.76,71.14 180 top
R91  200K  [R0201]  131.17,73.24 180 top
R92  12.7K 0.1%  [R0201]  129.86,73.24 180 top
R93  4.64K 0.1%  [R0201]  128.55,73.24 180 top
R94  4.64K 0.1%  [R0201]  127.25,73.24 180 top
R95  8.87K 0.1%  [R0201]  125.93,73.24 180 top
R96  30.9K 0.1%  [R0201]  125.93,72.52 0 top
R97  DNI  [R0201]  140.89,76.88 90 top
R98  100K  [R0201]  140.13,76.63 270 top
R99  10K  [0402]  128.33,88.3 270 top
R100  10K  [0402]  132.94,84.64 180 top
R101  10K  [R0201]  137.04,89.76 270 top
R102  2.2K  [R0201]  139.18,82.9 270 top
R103  10K  [0402]  130.96,97.07 90 top
R104  0.010R  [2512]  143.57,88.33 90 top
R105  6.19K  [R0201]  129.86,72.5 180 top
R106  49.9K  [R0201]  135.15,74.25 90 top
R107  19.9K  [R0201]  129.87,71.01 180 top
R108  150K  [R0201]  129.87,71.76 180 top
R109  19.9K  [R0201]  129.86,70.26 180 top
R110  0.010R  [2512]  132.73,77.55 90 top
R111  1K  [R0201]  137.16,69.29 0 top
R112  1K  [R0201]  137.16,70.04 0 top
R113  10K  [R0201]  137.16,71.14 180 top
R114  200K  [R0201]  155.27,73.24 180 top
R115  12.7K 0.1%  [R0201]  153.96,73.24 180 top
R116  4.64K 0.1%  [R0201]  152.65,73.24 180 top
R117  4.64K 0.1%  [R0201]  151.35,73.24 180 top
R118  8.87K 0.1%  [R0201]  150.03,73.24 180 top
R119  30.9K 0.1%  [R0201]  150.03,72.52 0 top
R120  100K  [R0201]  164.99,76.88 90 top
R121  DNI  [R0201]  164.23,76.63 270 top
R122  10K  [0402]  152.43,88.3 270 top
R123  10K  [0402]  157.04,84.64 180 top
R124  10K  [R0201]  161.14,89.76 270 top
R125  2.2K  [R0201]  163.28,82.9 270 top
R126  10K  [0402]  155.14,97.04 90 top
R127  0.010R  [2512]  167.67,88.33 90 top
R128  6.19K  [R0201]  153.96,72.5 180 top
R129  49.9K  [R0201]  159.25,74.25 90 top
R130  19.9K  [R0201]  153.97,71.01 180 top
R131  150K  [R0201]  153.97,71.76 180 top
R132  19.9K  [R0201]  153.96,70.26 180 top
R133  0.010R  [2512]  156.83,77.55 90 top
R134  1K  [R0201]  161.26,69.29 0 top
R135  1K  [R0201]  161.26,70.04 0 top
R136  10K  [R0201]  161.26,71.14 180 top
R137  200K  [R0201]  179.07,73.24 180 top
R138  12.7K 0.1%  [R0201]  177.76,73.24 180 top
R139  4.64K 0.1%  [R0201]  176.45,73.24 180 top
R140  4.64K 0.1%  [R0201]  175.15,73.24 180 top
R141  8.87K 0.1%  [R0201]  173.83,73.24 180 top
R142  30.9K 0.1%  [R0201]  173.83,72.52 0 top
R143  DNI  [R0201]  188.79,76.88 90 top
R144  100K  [R0201]  188.03,76.63 270 top
R145  10K  [0402]  176.23,88.3 270 top
R146  10K  [0402]  180.84,84.64 180 top
R147  10K  [R0201]  184.94,89.76 270 top
R148  2.2K  [R0201]  187.08,82.9 270 top
R149  10K  [0402]  178.86,97.03 90 top
R150  0.010R  [2512]  191.47,88.33 90 top
R151  6.19K  [R0201]  177.76,72.5 180 top
R152  49.9K  [R0201]  183.05,74.25 90 top
R153  19.9K  [R0201]  177.77,71.01 180 top
R154  150K  [R0201]  177.77,71.76 180 top
R155  19.9K  [R0201]  177.76,70.26 180 top
R156  0.010R  [2512]  180.63,77.55 90 top
R157  1K  [R0201]  185.06,69.29 0 top
R158  1K  [R0201]  185.06,70.04 0 top
R159  10K  [R0201]  185.06,71.14 180 top
R160  200K  [R0201]  107.17,73.24 180 top
R161  12.7K 0.1%  [R0201]  105.86,73.24 180 top
R162  4.64K 0.1%  [R0201]  104.55,73.24 180 top
R163  4.64K 0.1%  [R0201]  103.25,73.24 180 top
R164  8.87K 0.1%  [R0201]  101.93,73.24 180 top
R165  30.9K 0.1%  [R0201]  101.93,72.52 0 top
R166  100K  [R0201]  116.89,76.88 90 top
R167  DNI  [R0201]  116.13,76.63 270 top
R168  10K  [0402]  104.33,88.3 270 top
R169  10K  [0402]  108.94,84.64 180 top
R170  10K  [R0201]  113.04,89.76 270 top
R171  2.2K  [R0201]  115.18,82.9 270 top
R172  10K  [0402]  107.04,97.04 90 top
R173  0.010R  [2512]  119.57,88.33 90 top
R174  6.19K  [R0201]  105.86,72.5 180 top
R175  49.9K  [R0201]  111.15,74.25 90 top
R176  19.9K  [R0201]  105.87,71.01 180 top
R177  150K  [R0201]  105.87,71.76 180 top
R178  19.9K  [R0201]  105.86,70.26 180 top
R179  0.010R  [2512]  108.73,77.55 90 top
R180  1K  [R0201]  113.16,69.29 0 top
R181  1K  [R0201]  113.16,70.04 0 top
R182  10K  [R0201]  113.16,71.14 180 top
R183  200K  [R0201]  83.17,73.24 180 top
R184  12.7K 0.1%  [R0201]  81.86,73.24 180 top
R185  4.64K 0.1%  [R0201]  80.55,73.24 180 top
R186  4.64K 0.1%  [R0201]  79.25,73.24 180 top
R187  8.87K 0.1%  [R0201]  77.93,73.24 180 top
R188  30.9K 0.1%  [R0201]  77.93,72.52 0 top
R189  DNI  [R0201]  92.89,76.88 90 top
R190  100K  [R0201]  92.13,76.63 270 top
R191  10K  [0402]  80.33,88.3 270 top
R192  10K  [0402]  84.94,84.64 180 top
R193  10K  [R0201]  89.04,89.76 270 top
R194  2.2K  [R0201]  91.18,82.9 270 top
R195  10K  [0402]  83.11,97.04 90 top
R196  0.010R  [2512]  95.57,88.33 90 top
R197  6.19K  [R0201]  81.86,72.5 180 top
R198  49.9K  [R0201]  87.15,74.25 90 top
R199  19.9K  [R0201]  81.87,71.01 180 top
R200  150K  [R0201]  81.87,71.76 180 top
R201  19.9K  [R0201]  81.86,70.26 180 top
R202  0.010R  [2512]  84.73,77.55 90 top
R203  1K  [R0201]  89.16,69.29 0 top
R204  1K  [R0201]  89.16,70.04 0 top
R205  27R  [R0201]  176.52,19.33 90 top
R206  27R  [R0201]  177.27,19.33 90 top
R207  4D03WGJ0332T5E  [742C083103JP]  186.34,24.62 270 top
R208  10K  [R0201]  155.75,12.34 0 top
R209  DNI  [R0201]  187.95,14.38 180 top
R210  1K  [R0201]  189.28,14.38 180 top
R211  1K  [R0201]  178.83,31.49 270 top
R212  4.7K  [0402]  168.56,16.74 180 top
R213  NC  [R0201]  181.04,12.25 0 top
R214  4.7K  [R0201]  180.77,11.06 90 top
R215  4D03WGJ0332T5E  [YC164-JR-0733RL]  173.21,40.14 0 top
R216  4D03WGJ0332T5E  [YC164-JR-0733RL]  169.4,40.14 0 top
R217  4D03WGJ0332T5E  [YC164-JR-0733RL]  165.59,40.14 0 top
R218  10K  [R0201]  89.16,71.14 180 top
R219  200K  [R0201]  60.07,73.24 180 top
R220  12.7K 0.1%  [R0201]  58.76,73.24 180 top
R221  4.64K 0.1%  [R0201]  57.45,73.24 180 top
R222  4.64K 0.1%  [R0201]  56.15,73.24 180 top
R223  8.87K 0.1%  [R0201]  54.83,73.24 180 top
R224  30.9K 0.1%  [R0201]  54.83,72.52 0 top
R226  3.3R  [R0201]  221.83,25.64 270 top
R227  3.3R  [R0201]  221.09,25.64 270 top
R228  3.3R  [R0201]  224.46,25.64 270 top
R229  3.3R  [R0201]  223.73,25.63 270 top
R230  49.9R  [R0201]  223.45,24.62 0 top
R231  49.9R  [R0201]  224.74,24.62 180 top
R232  49.9R  [R0201]  222.11,24.63 0 top
R233  49.9R  [R0201]  220.81,24.63 180 top
R234  12.4K 1%  [R0201]  226.03,28.56 90 top
R235  1M  [R0201]  231.69,41.41 90 top
R236  4.7K  [R0201]  218.52,37.04 270 top
R237  470R  [0402]  214.89,19.58 270 top
R238  470R  [0402]  230.03,19.46 270 top
R239  470R  [0402]  218.12,19.85 180 top
R240  10K  [0402]  212.92,15.9 270 top
R241  499K  [R0201]  42.67,7.75 0 top
R242  7.5K  [R0201]  47.88,5.05 270 top
R243  10R  [R0201]  42.67,8.75 0 top
R244  100K  [R0201]  47.07,5.05 90 top
R245  100K  [R0201]  69.79,76.88 90 top
R246  DNI  [R0201]  69.03,76.63 270 top
R247  10K  [0402]  57.23,88.3 270 top
R248  10K  [0402]  61.84,84.64 180 top
R249  2.2K 1%  [R0201]  170.78,8.04 90 top
R250  5.1K  [R0201]  174.56,8.05 90 top
R251  5.1K  [R0201]  171.56,8.04 90 top
R252  10K  [0402]  183.45,2.42 180 top
R253  4D03WGJ0332T5E  [742C083103JP]  183.98,4.73 0 top
R254  499K  [R0201]  9.15,59.86 0 top
R255  1M  [0402]  178.64,3.07 90 top
R256  7.5K  [R0201]  14.36,57.16 270 top
R257  10R  [R0201]  9.15,60.86 0 top
R258  100K  [R0201]  13.55,57.16 90 top
R259  10K  [R0201]  65.94,89.76 270 top
R260  2.2K  [R0201]  68.08,82.9 270 top
R261  10K  [0402]  59.9,97 90 top
R262  0.010R  [2512]  72.47,88.33 90 top
R263  499K  [R0201]  31.08,60.23 0 top
R264  7.5K  [R0201]  36.29,57.53 270 top
R265  10R  [R0201]  31.08,61.23 0 top
R266  100K  [R0201]  35.48,57.53 90 top
R267  6.19K  [R0201]  58.76,72.5 180 top
R268  49.9K  [R0201]  64.05,74.25 90 top
R269  19.9K  [R0201]  58.77,71.01 180 top
R270  150K  [R0201]  58.77,71.76 180 top
R271  19.9K  [R0201]  58.76,70.26 180 top
R272  0.010R  [2512]  61.63,77.55 90 top
R273  1K  [R0201]  66.06,69.29 0 top
R274  1K  [R0201]  66.06,70.04 0 top
R275  10K  [R0201]  66.06,71.14 180 top
REF1  LM4040BXX  [SOT23]  166.56,19.04 90 top
RESET  430182043816  [430182050816]  160.01,16.38 270 top
RFB3  40.2K  [R0201]  43.01,5.1 0 top
RFB4  12.7K 1%  [R0201]  44.33,4.34 0 top
RFB7  40.2K  [R0201]  9.49,57.21 0 top
RFB8  7.5K 1%  [R0201]  10.81,56.45 0 top
RFB11  40.2K  [R0201]  31.42,57.58 0 top
RFB12  7.5K 1%  [R0201]  32.74,56.82 0 top
RT1  33K  [R0201]  44.34,5.1 180 top
RT3  20K 1%  [R0201]  10.82,57.21 180 top
RT5  20K 1%  [R0201]  32.75,57.58 180 top
T6  DMP3013SFV  [POWERDI3333-8_UX_DIO-L]  226.29,87.42 90 top
T7  DMP3013SFV  [POWERDI3333-8_UX_DIO-L]  230.38,87.41 270 top
T8  DMP3013SFV  [POWERDI3333-8_UX_DIO-L]  234.44,87.4 270 top
T9  BSZ065N06LS5ATMA1  [POWERDI3333-8_UX_DIO-L]  236.03,68.9 0 top
T10  BSZ065N06LS5ATMA1  [POWERDI3333-8_UX_DIO-L]  236.06,73 180 top
T11  DMP3013SFV  [POWERDI3333-8_UX_DIO-L]  202.49,87.42 90 top
T12  DMP3013SFV  [POWERDI3333-8_UX_DIO-L]  206.58,87.41 270 top
T13  DMP3013SFV  [POWERDI3333-8_UX_DIO-L]  210.64,87.4 270 top
T14  BSZ065N06LS5ATMA1  [POWERDI3333-8_UX_DIO-L]  212.23,68.9 0 top
T15  BSZ065N06LS5ATMA1  [POWERDI3333-8_UX_DIO-L]  212.26,73 180 top
T16  DMP3013SFV  [POWERDI3333-8_UX_DIO-L]  130.89,87.42 90 top
T17  DMP3013SFV  [POWERDI3333-8_UX_DIO-L]  134.98,87.41 270 top
T18  DMP3013SFV  [POWERDI3333-8_UX_DIO-L]  139.04,87.4 270 top
T19  BSZ065N06LS5ATMA1  [POWERDI3333-8_UX_DIO-L]  140.63,68.9 0 top
T20  BSZ065N06LS5ATMA1  [POWERDI3333-8_UX_DIO-L]  140.66,73 180 top
T21  DMP3013SFV  [POWERDI3333-8_UX_DIO-L]  154.99,87.42 90 top
T22  DMP3013SFV  [POWERDI3333-8_UX_DIO-L]  159.08,87.41 270 top
T23  DMP3013SFV  [POWERDI3333-8_UX_DIO-L]  163.14,87.4 270 top
T24  BSZ065N06LS5ATMA1  [POWERDI3333-8_UX_DIO-L]  164.73,68.9 0 top
T25  BSZ065N06LS5ATMA1  [POWERDI3333-8_UX_DIO-L]  164.76,73 180 top
T26  DMP3013SFV  [POWERDI3333-8_UX_DIO-L]  178.79,87.42 90 top
T27  DMP3013SFV  [POWERDI3333-8_UX_DIO-L]  182.88,87.41 270 top
T28  DMP3013SFV  [POWERDI3333-8_UX_DIO-L]  186.94,87.4 270 top
T29  BSZ065N06LS5ATMA1  [POWERDI3333-8_UX_DIO-L]  188.53,68.9 0 top
T30  BSZ065N06LS5ATMA1  [POWERDI3333-8_UX_DIO-L]  188.56,73 180 top
T31  DMP3013SFV  [POWERDI3333-8_UX_DIO-L]  106.89,87.42 90 top
T32  DMP3013SFV  [POWERDI3333-8_UX_DIO-L]  110.98,87.41 270 top
T33  DMP3013SFV  [POWERDI3333-8_UX_DIO-L]  115.04,87.4 270 top
T34  BSZ065N06LS5ATMA1  [POWERDI3333-8_UX_DIO-L]  116.63,68.9 0 top
T35  BSZ065N06LS5ATMA1  [POWERDI3333-8_UX_DIO-L]  116.66,73 180 top
T36  DMP3013SFV  [POWERDI3333-8_UX_DIO-L]  82.89,87.42 90 top
T37  DMP3013SFV  [POWERDI3333-8_UX_DIO-L]  86.98,87.41 270 top
T38  DMP3013SFV  [POWERDI3333-8_UX_DIO-L]  91.04,87.4 270 top
T39  BSZ065N06LS5ATMA1  [POWERDI3333-8_UX_DIO-L]  92.63,68.9 0 top
T40  BSZ065N06LS5ATMA1  [POWERDI3333-8_UX_DIO-L]  92.66,73 180 top
T41  DMP3013SFV  [POWERDI3333-8_UX_DIO-L]  59.79,87.42 90 top
T42  DMP3013SFV  [POWERDI3333-8_UX_DIO-L]  63.88,87.41 270 top
T43  DMP3013SFV  [POWERDI3333-8_UX_DIO-L]  67.94,87.4 270 top
T44  BSZ065N06LS5ATMA1  [POWERDI3333-8_UX_DIO-L]  69.53,68.9 0 top
T45  BSZ065N06LS5ATMA1  [POWERDI3333-8_UX_DIO-L]  69.56,73 180 top
U$1  [ROHS_LOGO_0.18_IN]  11.07,3.45 0 top
U$2  [OSHW-LOGO-L]  22.31,5.12 0 top
USB9  [USB-C]  172.74,3.06 0 top
USBA_1-2  61400826021  [61400826021]  19.22,93.71 180 top
USBA_3-4  61400826021  [61400826021]  39.54,93.71 180 top
VO3  TP  [TP]  41.26,5.04 90 top
VO5A  TP  [TP]  7.74,57.15 90 top
VO5B  TP  [TP]  29.67,57.52 90 top
VREF  TP  [TP]  168.73,15.07 180 top
VUSBA1  TPB1,27  [B1,27]  17.15,74.08 270 top
VUSBA2  TPB1,27  [B1,27]  27.65,74.47 270 top
VUSBA3  TPB1,27  [B1,27]  37.65,74.36 270 top
VUSBA4  TPB1,27  [B1,27]  50.17,77.78 90 top
X1  X322512MSB4SI  [WE-XTAL_CFPX-180]  179.1,35.53 180 top
X2  X322525MOB4SI  [WE-XTAL_CFPX-180]  229.74,41.42 270 top

## Tracks (layer width: path | path; a pad name or v marks a point on that pad's centre or on a via)
3V3_EN_SYS1
  SIG-HS 0.254: IC40.6 43.55,7.67 43.47,7.75 R241.2
3V3_EN_SYS3
  SIG-HS 0.254: IC43.6 10.03,59.77 9.95,59.86 R254.2
3V3_EN_SYS5
  SIG-HS 0.254: IC45.6 31.97,60.15 31.88,60.23 R263.2
24VINA
  SIG-HS 3: J8.2 17.25,33.2 F2.1_1 F2.1_2
  pour SIG-HS (isolate 0.203, no thermals): 6.3,35.5 6.3,30.8 22.7,30.8 22.7,36.7 11.4,36.7 10.7,36 6.8,36
  pour SIG (isolate 0.203, no thermals): 6.3,35.5 6.3,30.8 22.7,30.8 22.7,36.7 11.4,36.7 10.7,36 6.8,36
24VINB
  SIG-HS 3: J8.3 15.83,28.12 F3.1_1 F3.1_2
  pour SIG-HS (isolate 0.203, no thermals): 6.3,30.2 22.7,30.2 22.7,24.7 22.4,24.4 11.2,24.4 10.7,24.9 6.8,24.9 6.3,25.4
  pour SIG (isolate 0.203, no thermals): 6.3,30.2 22.7,30.2 22.7,24.7 22.4,24.4 11.2,24.4 10.7,24.9 6.8,24.9 6.3,25.4
24VINC
  SIG-HS 3: F1.1_2 F1.1_1 9.92,39.84 J8.1
  pour SIG-HS (isolate 0.203, no thermals): 21.8,41.3 7.1,41.3 6.4,40.6 6.4,37 6.9,36.5 10.5,36.5 11.4,37.4 22.7,37.4 22.7,40.4
  pour SIG (isolate 0.203, no thermals): 21.8,41.3 7.1,41.3 6.4,40.6 6.4,37 6.9,36.5 10.5,36.5 11.4,37.4 22.7,37.4 22.7,40.4
!ACT  (via drill 0.2)
  SIG-HS 0.2: IC39.27 226.03,40.39 226.42,40.78 227.42,40.78 227.95,40.25 227.95,39.53 228.97,38.51 229.97,38.51 v230.46,38.02 | v229.94,21.44 230.03,21.35 R238.1
  SIG 0.2: v230.46,38.02 229.85,37.41 229.85,21.53 v229.94,21.44
!LINK  (via drill 0.2)
  SIG-HS 0.2: IC39.25 227.03,37.61 v226.06,36.64 | v214.87,21.54 214.89,21.52 R237.1
  SIG 0.2: v226.06,36.64 220.85,31.43 220.85,28.8 220.56,28.51 220.56,25.05 217.04,21.53 v214.88,21.53 v214.87,21.54
!QSPI_SS
  SIG-HS 0.2: IC26.56 180.73,21.51 180.87,21.37 188.99,21.37 189.88,20.48 189.88,16.26 189.24,15.62 IC27.1 188.21,14.39 R209.1 R210.2
!TCA_RST  (via drill 0.2)
  SIG-HS 0.2: IC26.36 173.67,25.21 173.16,24.7 172.26,24.7 170.95,26.01 170.95,28.7 v170.64,29.01 | v172.74,34.86 171.64,33.76 IC38.24
  PWR 0.2: v170.64,29.01 170.64,29.23 169.18,30.7 169.18,31.31 171.28,33.41 171.3,33.41 v172.74,34.86
!W5500_CS  (via drill 0.2)
  SIG-HS 0.2: IC26.28 174.62,28.85 174.28,29.19 174.28,30.42 174.92,31.06 175.28,31.06 v175.74,31.52 | v222.54,41.86 223.53,40.87 IC39.32
  SIG 0.2: v175.74,31.52 176.24,31.52 176.37,31.39 176.89,31.39 177.25,31.76 177.25,32.12 178.58,33.45 210.32,33.45 214.7,37.83 215.56,37.83 218.29,40.56 218.29,41.48 218.78,41.97 222.43,41.97 v222.54,41.86
!W5500_INT  (via drill 0.2)
  SIG-HS 0.2: IC26.32 173.01,26.81 172.6,27.22 172.6,27.42 172.25,27.77 172.25,30.42 172.3,30.47 172.3,31.04 173.18,31.92 v173.18,32.56 | v215.57,39.87 221.44,39.87 221.53,39.78 IC39.36
  SIG 0.2: v173.18,32.56 175.58,34.96 209.69,34.96 214.6,39.87 v215.57,39.87
!W5500_RST  (via drill 0.2)
  SIG-HS 0.2: IC26.31 173.14,27.21 172.98,27.38 172.98,27.58 172.63,27.92 172.63,30.27 172.68,30.31 172.68,30.88 173.74,31.95 v173.81,31.95 | v214.83,39.22 217.58,39.22 218.85,37.95 | IC39.37 218.98,37.82 218.85,37.95 | R236.1 218.85,37.65 218.85,37.95
  SIG 0.2: v173.81,31.95 173.81,32.66 175.74,34.58 209.85,34.58 214.48,39.22 v214.83,39.22
+1V1  (via drill 0.2)
  SIG-HS 0.2: IC26.50 178.33,20.7 178.79,20.24 C193.1 | IC26.45 176.33,21.13 175.78,20.58 175.78,20.36 C194.1 | IC26.23 177.53,31.02 C192.1 | DVDD.TP 176.09,32.56 v176.63,32.02
  SIG-HS 0.203: C192.1 177,31.21 176.63,31.58 v176.63,32.02 | v179.56,19.1 179.06,19.61 C193.1 | v176.07,20.32 175.82,20.32 175.78,20.36
  PWR 0.203: v176.63,32.02 177.51,31.14 177.51,28.78 177.34,28.61 175.47,28.61 175,28.14 175,20.63 175.36,20.27 176.17,20.27 | v179.56,19.1 178.39,20.27 176.17,20.27 | 176.17,20.27 176.12,20.32 v176.07,20.32
+3V3  (via drill 0.2, 0.2 pad 0.35)
  SIG-HS 0.2: 177.93,20.89 IC26.49 177.74,21.97 IC26.48 | C185.1 175.04,20.37 175.93,21.26 IC26.44 175.93,22.88 175.79,23.02 | C189.1 IC26.33 175.69,26.41 175.7,26.42 | 174.03,22.81 IC26.42 175.4,22.81 175.7,23.11 | 174.03,22.81 C190.1 | C195.1 174.02,22.8 174.03,22.81 | C188.1 177.93,31.07 IC26.22 177.93,27.78 177.92,27.77 | C187.1 182.79,22.66 182.64,22.81 IC26.1 | R213.2 184.23,12.25 184.66,11.82 IC29.8 185.49,11.3 C183.1 | R209.2 183.14,14.38 182.51,15.01 182.51,15.6 | 182.51,15.6 IC27.8 | C176.1 182.51,15.6 | IC38.21 171.19,32.01 | 171.19,32.01 C212.1 171.19,32.01 | 171.19,32.01 171.74,31.46 | 171.74,31.46 C213.1 | v220.19,31.08 219.79,30.68 L10.1 218.78,31.06 v218.78,31.65 | IC39.43 218.69,34.82 C221.1 | IC39.45 218.72,33.82 C223.1 | IC39.43 221.62,34.82 v221.65,34.85 | IC39.45 221.64,33.82 v221.67,33.79 | R236.2 218.51,36.76 v218.51,36.05 | IC26.1 181.47,22.81 | R253.1 183.04,3.93 | 183.04,3.93 R253.2 R253.3 R253.4 v186.43,3.93 v186.44,3.94 | IC26.1 181.57,22.75 181.6,22.72 | 180.5,26.39 180.52,26.41 IC26.10 183.12,26.41 184.33,27.62 C184.1 | C182.1 IC28.2 v171.45,19.26 v171.46,19.25 | C249.1 165.22,24.09 IC42.5 165.22,23.36 C251.1 164.6,22.62 v164.6,22.45 | R208.1 154.78,12.34 v154.76,12.36 | R50.1 235.98,76.3 235.98,76.07 235.26,75.34 233.69,75.34 232.88,74.53 v232.88,72.69 232.88,71.18 R66.1 | 242.29,84.1 v242.11,83.92 | R97.1 140.58,76.3 140.58,76.07 139.86,75.34 138.29,75.34 137.47,74.52 v137.47,72.67 137.47,71.17 R113.1 | C97.1 148.6,85.36 v148.42,85.18 | R73.1 212.18,76.3 212.18,76.07 211.46,75.34 209.89,75.34 209.07,74.53 v209.07,72.68 209.07,71.18 R90.1 | C74.1 220.21,85.36 v220.02,85.18
  SIG-HS 0.2: R143.1 188.48,76.3 188.48,76.07 187.76,75.34 186.19,75.34 185.37,74.52 v185.37,72.72 185.37,71.17 R159.1 | C135.1 196.5,85.36 v196.32,85.18 | R120.1 164.68,76.3 164.68,76.07 163.96,75.34 162.39,75.34 161.62,74.57 v161.62,72.57 161.62,71.22 R136.1 | C116.1 172.7,85.36 v172.52,85.18 | R166.1 116.58,76.3 116.58,76.07 115.86,75.34 114.29,75.34 113.52,74.57 v113.52,72.73 113.52,71.22 R182.1 | C154.1 124.6,85.36 v124.42,85.18 | R189.1 92.58,76.3 92.58,76.07 91.86,75.34 90.29,75.34 89.47,74.52 v89.47,72.76 89.47,71.17 R218.1 | C173.1 100.61,85.36 v100.42,85.18 | R245.1 69.48,76.3 69.48,76.07 68.76,75.34 67.19,75.34 66.34,74.49 v66.34,72.7 R275.1 | C241.1 77.5,85.36 v77.32,85.18 | C222.1 225.53,40.66 IC39.28 225.53,37.9 v225.43,37.8 | IOVDD.TP 187.33,23.23 R207.5 | R252.2 182.85,2.47 182.85,3.74 183.04,3.93 | IC22.7 171.53,89.08 172.82,87.78 IC22.4 | IC25.8 194.62,89.92 v194.62,90.86 | IC44.7 76.33,89 77.15,88.17 77.45,88.17 77.62,88 IC44.4 | IC36.8 98.78,91.11 v98.67,91.22 | v171.67,30.73 171.67,31.26 C213.1 | IC39.43 IC39.44 IC39.45 | R217.8 R217.7 R217.6 R217.5 R216.8 R216.7 R216.6 R216.5 R215.8 R215.7 R215.6 R215.5 176.53,40.95 v176.77,40.71 | R7.1 33.08,70.12 v32.83,69.87 | R4.1 v23.38,69.8 v23.39,69.79 | IC33.7 123.42,89.28 124.72,87.97 IC33.4 | 171.19,32.01 | IC38.21 | C213.1 171.74,31.46 | 171.74,31.46 | R10.1 44.78,69.45 v44.75,69.42
  SIG-HS 0.203: C176.1 181.44,14.79 v181.48,14.74 | C183.1 185.51,11.98 v185.57,12.04 | R213.2 v181.31,12.96 v181.32,12.96 | v188.44,25.5 188.12,25.82 R207.8 R207.7 R207.6 R207.5 v187.14,22.35 | v175.82,27.72 175.87,27.77 175.92,27.77 | v175.78,23.04 v175.77,23.04 175.7,23.11 | v180.4,27.69 180.34,27.69 180.26,27.77 | C186.1 178.02,20.48 177.93,20.57 177.93,20.89 | R19.2 48.87,68.5 R18.2 50.09,69.72 51.58,69.72 51.82,69.48 R21.2 51.82,68.22 v51.8,68.2 | C20.1 49.95,62 48.78,62 | C19.1 50.1,66.7 48.93,66.7 | IC16.7 219.03,89.17 220.32,87.88 IC16.4
  SIG-HS 0.254: C236.1 RFB3.1 v42.74,5.94 42.74,5.14 41.26,5.14 VO3.TP | L11.2 47.65,11.99 | 47.65,11.99 49.57,11.99 49.71,12.13 49.98,11.86 C239.1 C238.1 | v48.93,12.56 47.84,12.56 47.65,12.37 47.65,11.99
  SIG-HS 0.305: R1.1 12.98,69.92 v13.2,69.92 | v7.3,67.8 7.15,67.65 IC5.5 5.81,67.92 R16.2 7.13,68.92 C18.1 | R22.2 48.78,63.17 48.78,62.98 | R19.2 48.87,66.61 IC6.5 48.93,66.7 48.93,67.63 49,67.7 v49.8,67.7 | v49.8,63.1 48.9,63.1 48.78,62.98 | IC7.5 48.78,62 48.78,62.98 | R15.2 5.86,75.21 R12.2 5.92,73.45 R13.2 5.95,72.33 IC4.5 6.95,72.15 v7.3,72.5 7.34,72.54 C17.1 | IC13.4 241.79,94.08 C55.1 242.44,93.96 v242.48,94 | IC19.4 148.72,86.4 C97.1 | IC16.4 220.32,86.4 C74.1 | IC25.4 196.62,86.4 C135.1 | IC22.4 172.82,86.4 C116.1 | IC22.8 IC22.7 | IC33.4 124.72,86.4 C154.1 | IC36.4 100.72,86.4 C173.1 | IC44.4 77.62,86.4 C241.1 | IC44.8 IC44.7
  SIG-HS 0.406: 177.74,21.97 177.7,22.01 177.7,22.97 177.65,23.02 175.79,23.02 175.7,23.11 175.7,26.42 175.7,27.55 175.92,27.77 177.92,27.77 180.26,27.77 180.5,27.53 180.5,26.39 180.5,23.18 180.97,22.72 181.6,22.72 | R212.2 166.62,16.74 v166.59,16.77 | DISP.2 201.42,3.72 201.92,4.22 DISP.1 201.92,6.6 v202.73,7.41
  SIG-HS 0.508: 218.98,30.5 L10.1
  PWR 0.2: v194.62,90.86 194.62,88.83 196.32,87.13 v196.32,85.18 | v98.67,91.22 100.42,89.47 v100.42,85.18
  SIG 0.2: v242.11,83.92 242.11,84.1 236.5,84.1 236.3,83.9 236.3,80.8 235.8,80.3 235.8,76 235.2,75.4 233.4,75.4 232.88,74.88 v232.88,72.69 | v148.42,85.18 147.34,84.1 141.1,84.1 140.9,83.9 140.9,80.8 140.4,80.3 140.4,76 139.8,75.4 138,75.4 137.47,74.86 v137.47,72.67 | v220.02,85.18 218.94,84.1 212.7,84.1 212.5,83.9 212.5,80.8 212,80.3 212,76 211.4,75.4 209.6,75.4 209.07,74.88 v209.07,72.68 | v196.32,85.18 195.24,84.1 189,84.1 188.8,83.9 188.8,80.8 188.3,80.3 188.3,76 187.7,75.4 185.9,75.4 185.37,74.86 v185.37,72.72 | v172.52,85.18 171.44,84.1 165.2,84.1 165,83.9 165,80.8 164.5,80.3 164.5,76 163.9,75.4 162.1,75.4 161.62,74.92 v161.62,72.57 | v124.42,85.18 123.34,84.1 117.1,84.1 116.9,83.9 116.9,80.8 116.4,80.3 116.4,76 115.8,75.4 114,75.4 113.52,74.92 v113.52,72.73 | v100.42,85.18 99.34,84.1 93.1,84.1 92.9,83.9 92.9,80.8 92.4,80.3 92.4,76 91.8,75.4 90,75.4 89.47,74.86 v89.47,72.76 | v77.32,85.18 76.24,84.1 70,84.1 69.8,83.9 69.8,80.8 69.3,80.3 69.3,76 68.7,75.4 66.9,75.4 66.34,74.83 v66.34,72.7
  SIG 0.254: v42.74,5.94 44.13,5.94 44.73,5.34 48.81,5.34 49.2,5.73 49.2,12.29 v48.93,12.56
  other vias: 48.93,13.36 48.93,14.16 48.93,11.76 48.03,14.16 48.03,13.36 48.03,12.56 48.03,11.76 47.13,11.76 47.13,12.56 47.13,13.36 47.13,14.16
  pour SIG-HS (isolate 0.254, no thermals): 46.55,14.64 46.55,9.54 48.55,9.54 48.55,10.64 51.35,10.64 51.35,14.64
  pour PWR (isolate 0.203, rank 6): 0,103 248,103 248,-2 0,-2
+3V3_A  (via drill 0.2)
  SIG-HS 0.2: IC39.4 223.03,29.22 C226.1 | IC39.4 223.05,30.87 223.05,25.4 222.38,24.73 R232.2 | C227.1 226.77,29.28 226.53,29.52 IC39.11 v226.53,32.28 | C225.1 225.03,28.84 IC39.8 v225.03,32.27 v225.04,32.28 | v220.22,29.06 220.14,28.98 L10.2 219.16,27.97 v219.18,27.95 220.53,26.59 220.53,24.66 | IC39.4 223.03,32.25 v223.01,32.27 | v227,33.32 IC39.15 C228.1 | v227.15,34.31 v227.16,34.32 IC39.17 C229.1 | v227.15,36.28 227.19,36.32 IC39.21 230.19,36.32 C224.1 | R233.2 220.53,24.66 | R239.2 217.47,23.6 218.53,24.66 220.53,24.66
  pour PWR: 229.69,38.27 227.62,38.27 226.53,37.18 226.53,33.99 225.45,32.91 222.18,32.91 220.87,31.6 220.87,30.72 219.88,29.73 218.54,29.73 218.38,29.57 218.38,27.59 218.52,27.45 219.42,27.45 222.42,30.45 228.28,30.45 229.69,31.86
+5V
  SIG-HS 0.406: DISP.4 200.42,3.96 200.92,4.46 DISP.3
+5VA  (via drill 0.2 pad 0.35)
  SIG-HS 0.254: C261.1 RFB7.1 v9.22,58.05 9.22,57.25 7.74,57.25 VO5A.TP | L13.2 14.13,64.1 | 14.13,64.1 16.05,64.1 16.19,64.24 16.46,63.97 C264.1 C263.1 | v15.41,64.67 14.32,64.67 14.13,64.48 14.13,64.1
  SIG-HS 0.508: IC8.1 10.05,74.78 C82.1
  SIG 0.254: v9.22,58.05 10.61,58.05 11.21,57.45 15.29,57.45 15.68,57.84 15.68,64.4 v15.41,64.67